# EAGLE schematic controller connectors (EAGLE 9.6.2)
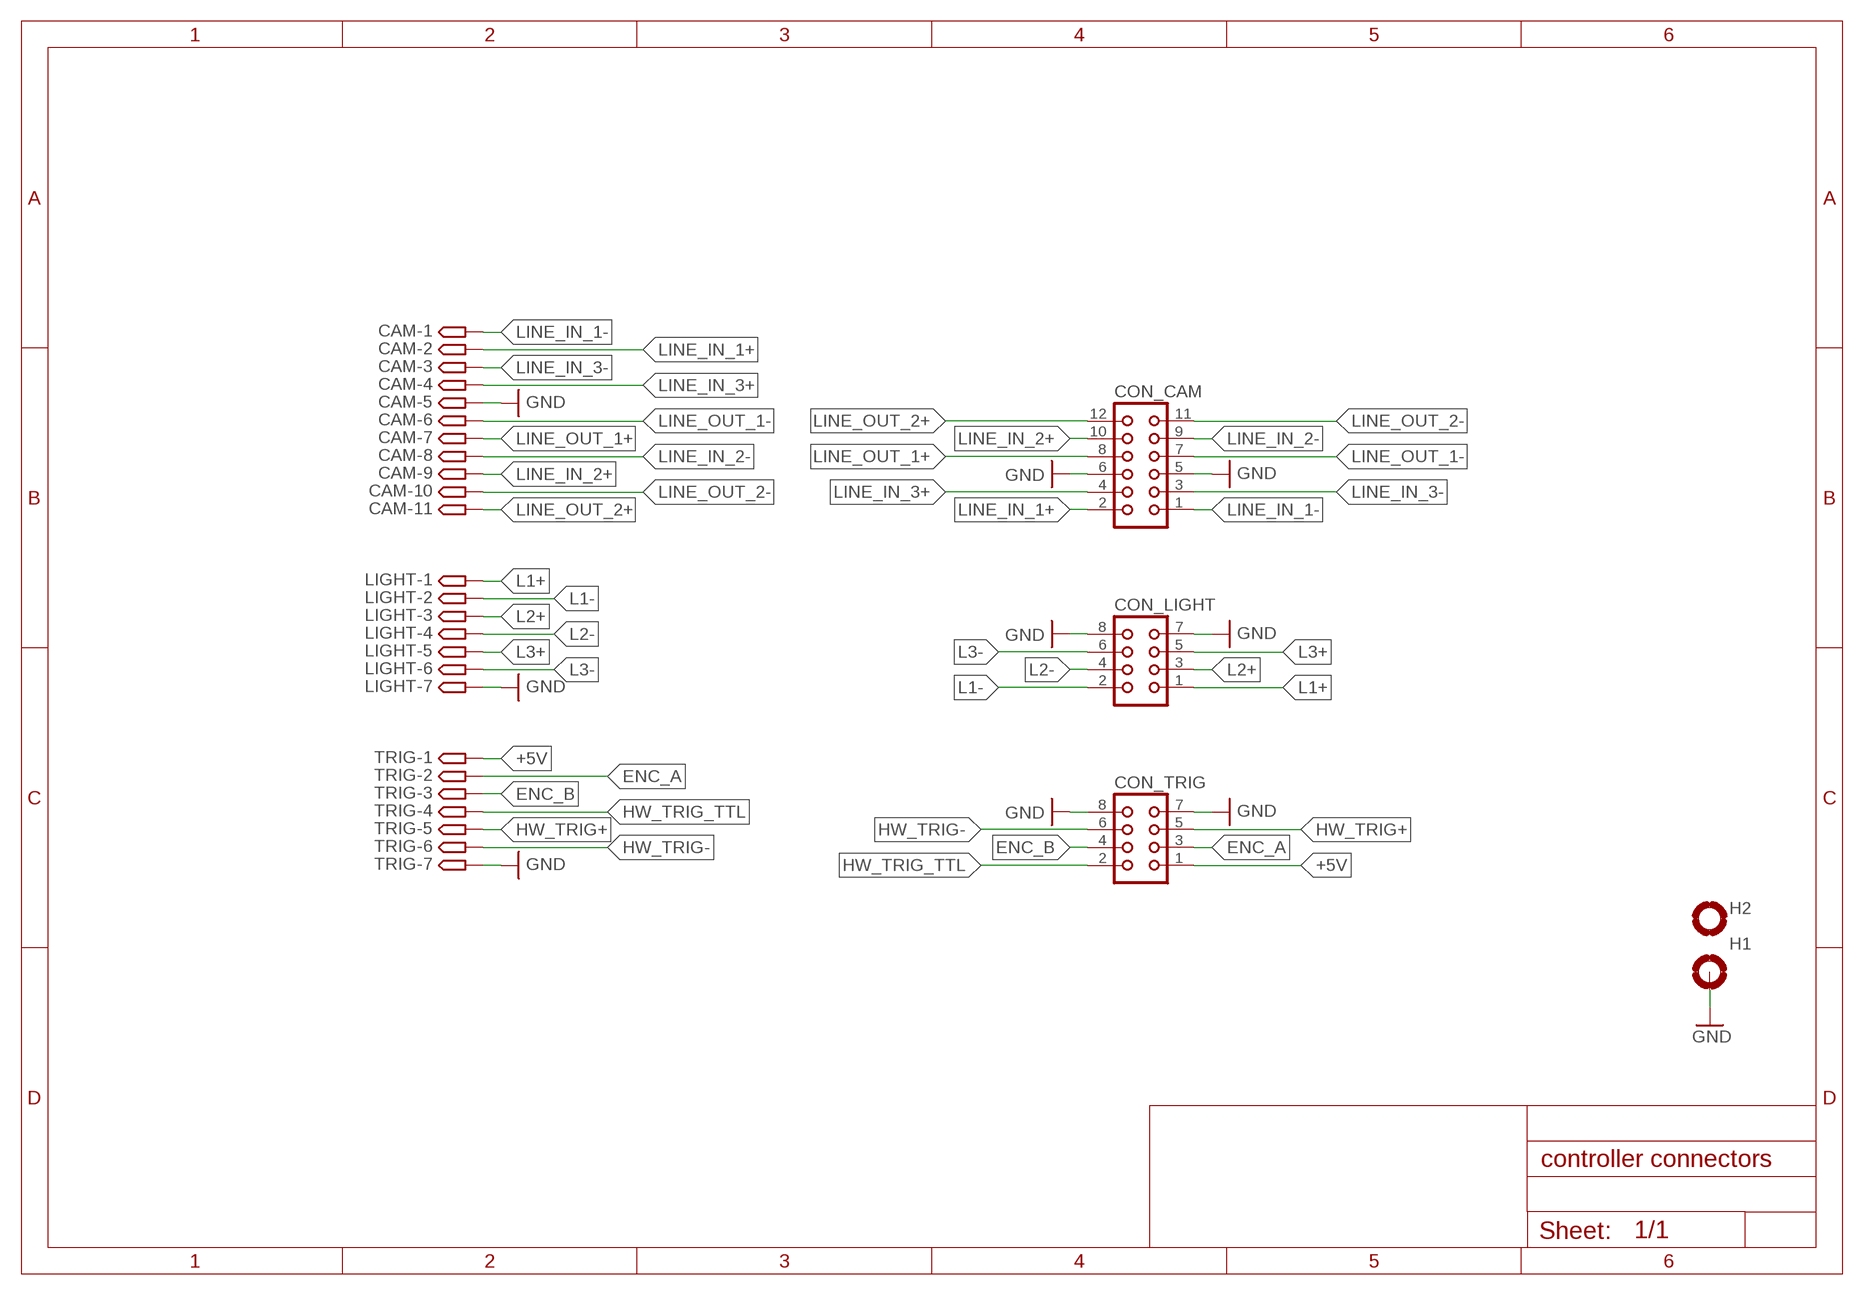
[diagram p0: schematic, sheet 1]

## Parts
CAM  SMPAD-11  [S-11P]
CON_CAM  CON12  [CON12_2MM]
CON_LIGHT  CON8  [CON8_2MM]
CON_TRIG  CON8  [CON8_2MM]
H1  HOLE-3MM_PLATED  [3MM_PLATED]
H2  HOLE_UNPLATED  [3MM_UNPLATED_1SIDE]
LIGHT  SMPAD-7  [S-7P]
TRIG  SMPAD-7  [S-7P]

## Nets
+5V: CON_TRIG.1 TRIG.1
ENC_A: CON_TRIG.3 TRIG.2
ENC_B: CON_TRIG.4 TRIG.3
GND: CAM.5 CON_CAM.5 CON_CAM.6 CON_LIGHT.7 CON_LIGHT.8 CON_TRIG.7 CON_TRIG.8 H1.1(MOUNT) LIGHT.7 TRIG.7
HW_TRIG+: CON_TRIG.5 TRIG.5
HW_TRIG-: CON_TRIG.6 TRIG.6
HW_TRIG_TTL: CON_TRIG.2 TRIG.4
L1+: CON_LIGHT.1 LIGHT.1
L1-: CON_LIGHT.2 LIGHT.2
L2+: CON_LIGHT.3 LIGHT.3
L2-: CON_LIGHT.4 LIGHT.4
L3+: CON_LIGHT.5 LIGHT.5
L3-: CON_LIGHT.6 LIGHT.6
LINE_IN_1+: CAM.2 CON_CAM.2
LINE_IN_1-: CAM.1 CON_CAM.1
LINE_IN_2+: CAM.9 CON_CAM.10
LINE_IN_2-: CAM.8 CON_CAM.9
LINE_IN_3+: CAM.4 CON_CAM.4
LINE_IN_3-: CAM.3 CON_CAM.3
LINE_OUT_1+: CAM.7 CON_CAM.8
LINE_OUT_1-: CAM.6 CON_CAM.7
LINE_OUT_2+: CAM.11 CON_CAM.12
LINE_OUT_2-: CAM.10 CON_CAM.11

## Library data of the parts
CAM = custom connectors:SMPAD-11
CON_CAM = custom connectors:CON12: CONNECTOR
CON_LIGHT CON_TRIG = custom connectors:CON8: CONNECTOR; OC_FARNELL: unknown; OC_NEWARK: unknown
H1 = custom mounting:HOLE
H2 = custom mounting:HOLE_UNPLATED
LIGHT TRIG = custom connectors:SMPAD-7